# Altium project UPA-DIP.PrjPcb
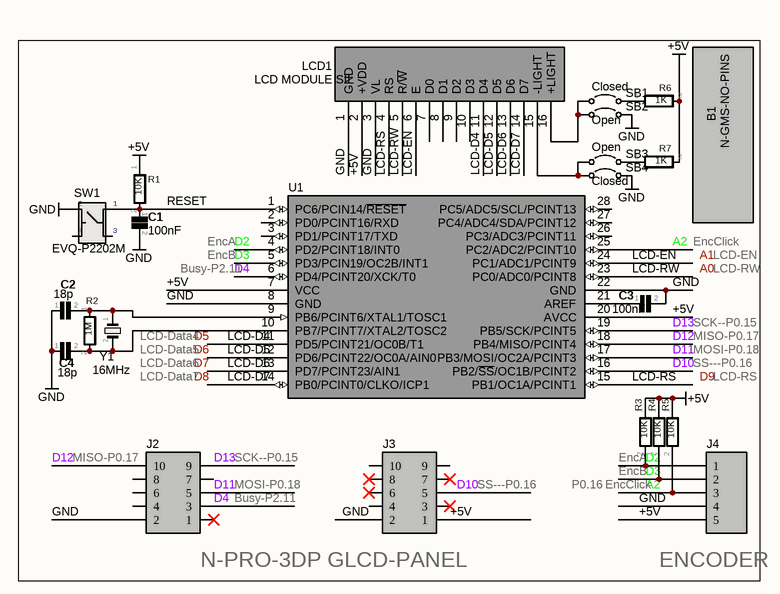
[diagram p0: UPA-DIP.SchDoc]
OrderQty: 40; prj: UPA-DIP-V2
1 sheet, 23 parts. Net scope: global (net labels, ports and power ports of the same name join across sheets).
Board file: UPA-DIP.PcbDoc

## Sheet UPA-DIP.SchDoc
size 139 x 101 mm; DocumentNumber: 1; SheetNumber: 1; SheetTotal: 1; PageSetup: Record=PageOptions|CenterHorizontal=True|CenterVertical=True|PrintScale=0.05|XCorrection=1.00|YCorrection=1.00|PrintKind=0|BorderSize=5000000|LeftOffset=0|BottomOffset=0|Orientation=2|PaperLength=1000|PaperWidth=1000|Scale=100|PaperSource=7|PrintQuality=-3|MediaType=1|DitherType=10|PrintScaleMode=1|PaperKind=12mm|PaperIndex=126

### Parts
B1  N-GMS-NO-PINS  [N-GMS-NO-PINS]
C1  100nF  [CK05]
C2  18p  [CK05]
C3  100nF  [CK05]
C4  18p  [CK05]
J2  Header 5X2  [ML10]  (value not drawn)
J3  Header 5X2  [ML10]  (value not drawn)
J4  HEADER_5  [1X05]  (value not drawn)
LCD1  LCD MODULE SIL  [1X16-FEMALE]
R1  10K  [RS-2,5]
R2  1M  [RS-2,5]
R3  10K  [RS-2,5]
R4  10K  [RS-2,5]
R5  10K  [RS-2,5]
R6  1Κ  [RS-2,5]
R7  1Κ  [RS-2,5]
SB1  Closed  [0603_JUMPER]
SB2  Open  [0603_JUMPER]
SB3  Open  [0603_JUMPER]
SB4  Closed  [0603_JUMPER]
SW1  EVQ-P2202M  [BUTTON_6X6mm]
U1  ATmega328PU  [DIL28-300wSOCKET]  (value not drawn)
Y1  16MHz  [HC49U-V]

### Nets
+5V: J3.1 J4.5 LCD1.2(+VDD) R1.1 R3.1 R4.1 R5.1 R6.2 R7.2 U1.7(VCC) U1.20(AVCC)
GND: C1.2 C2.1 C3.2 C4.1 J2.2 J3.2 J4.4 LCD1.1(GND) LCD1.3(VL) SB2.2 SB4.2 SW1.2 U1.8(GND) U1.22(GND)
A2: J4.3 R5.2 U1.25(PC2/ADC2/PCINT10)
D2: J4.1 R3.2 U1.4(PD2/PCINT18/INT0)
D3: J4.2 R4.2 U1.5(PD3/PCIN19/OC2B/INT1)
D4: J2.3 U1.6(PD4/PCINT20/XCK/T0)
D10: J3.5 U1.16(PB2/~{SS}/OC1B/PCINT2)
D11: J2.5 U1.17(PB3/MOSI/OC2A/PCINT3)
D12: J2.10 U1.18(PB4/MISO/PCINT4)
D13: J2.9 U1.19(PB5/SCK/PCINT5)
LCD-D4: LCD1.11(D4) U1.11(PD5/PCINT21/OC0B/T1)
LCD-D5: LCD1.12(D5) U1.12(PD6/PCINT22/OC0A/AIN0)
LCD-D6: LCD1.13(D6) U1.13(PD7/PCINT23/AIN1)
LCD-D7: LCD1.14(D7) U1.14(PB0/PCINT0/CLKO/ICP1)
LCD-EN: LCD1.6(E) U1.24(PC1/ADC1/PCINT9)
LCD-RS: LCD1.4(RS) U1.15(PB1/OC1A/PCINT1)
LCD-RW: LCD1.5(R/~{W}) U1.23(PC0/ADC0/PCINT8)
RESET: C1.1 R1.2 SW1.1 U1.1(PC6/PCIN14/~{RESET})
NetC2_2: C2.2 R2.1 U1.9(PB6/PCINT6/XTAL1/TOSC1) Y1.1
NetC3_1: C3.1 U1.21(AREF)
NetC4_2: C4.2 R2.2 U1.10(PB7/PCINT7/XTAL2/TOSC2) Y1.2
NetLCD1_15: LCD1.15(-LIGHT) SB3.1 SB4.1
NetLCD1_16: LCD1.16(+LIGHT) SB1.1 SB2.1
NetR6_1: R6.1 SB1.2
NetR7_1: R7.1 SB3.2

Not connected (* = marked no-connect by the designer): J2 1* 4 6 7 8; J3 3* 4 6* 7* 8* 9 10; LCD1 7(D0) 8(D1) 9(D2) 10(D3); SW1 3 4; U1 2(PD0/PCINT16/RXD) 3(PD1/PCINT17/TXD) 26(PC3/ADC3/PCINT11) 27(PC4/ADC4/SDA/PCINT12) 28(PC5/ADC5/SCL/PCINT13)

### Notes on the sheet
- EncA
- EncB
- EncClick
- LCD-EN
- (near Y1) LCD-Data4
- Busy-P2.11
- (near C3) SCK--P0.15
- MISO-P0.17
- LCD-RW
- (near Y1) LCD-Data5
- LCD-Data6
- LCD-Data7
- MOSI-P0.18
- SS---P0.16
- LCD-RS
- (near J2) MISO-P0.17
- (near J2) SCK--P0.15
- (near R3) EncA
- (near J2) MOSI-P0.18
- (near J2) Busy-P2.11
- (near J3) SS---P0.16
- P0.16
- N-PRO-3DP GLCD-PANEL
- (near J4) ENCODER
- Labels drawn without touching a wire or pin: A0, A1, D5, D6, D7, D8, D9

### Library data of the parts
C1-C4 = C: CAPACITOR; Divider: 1; Supplier 1: Mouser
  C1 C3: Supplier Part Number 1: 594-K104K15X7RF53H5
J2 J3 = Header 5X2: Header, 5-Pin, Dual row; Divider: 1; Revision: 17-Jul-2002: Re-released for DXP Platform.; Supplier 1: Mouser; Supplier Part Number 1: 517-30310-6002
LCD1 = LCD MODULE SIL_1: LCD MODULE SINGLE IN LINE
R1-R7 = R: RESISTOR; Divider: 1; Supplier 1: Mouser
  R1 R3-R7: Supplier Part Number 1: 594-SFR25H0001002JR5
SB1-SB4 = HEADER2_CIRCUIT_BRAKER: Circuit Breaker; Solder: NO; Published: 24-Mar-1999; Revision: July-2002: Re-released for DXP Platform.; Publisher: Altium Limited
SW1 = BUTTON_TACT: BUTTON TACTILE; Divider: 1; Supplier 1: Mouser; Supplier Part Number 1: 667-EVQ-P2202M
U1 = ATmega48/88/168: 8-Bit AVR Microcontroller with 32K Bytes of In-System Programmable Flash Memory; Published: 17-Sep-2003; LatestRevisionDate: 04-Mar-2005; LatestRevisionNote: Stylized 3D Model Added.; DatasheetVersion: 2503C-AVR-10/02; PackageVersion: Dec-1999; PackageReference: 40P6; Publisher: Altium Limited; PackageDescription: DIP; 40 Leads; Row Spacing 15.24 mm; Pitch 2.54 mm; ComponentLink1Description: Manufacturer Link; ComponentLink1URL: http://www.atmel.com; ComponentLink2Description: Datasheet; ComponentLink2URL: http://www.atmel.com/dyn/resources/prod_documents/doc2503.pdf
Y1 = XTAL: CRYSTAL